# Altium project Final_project.PrjPcb
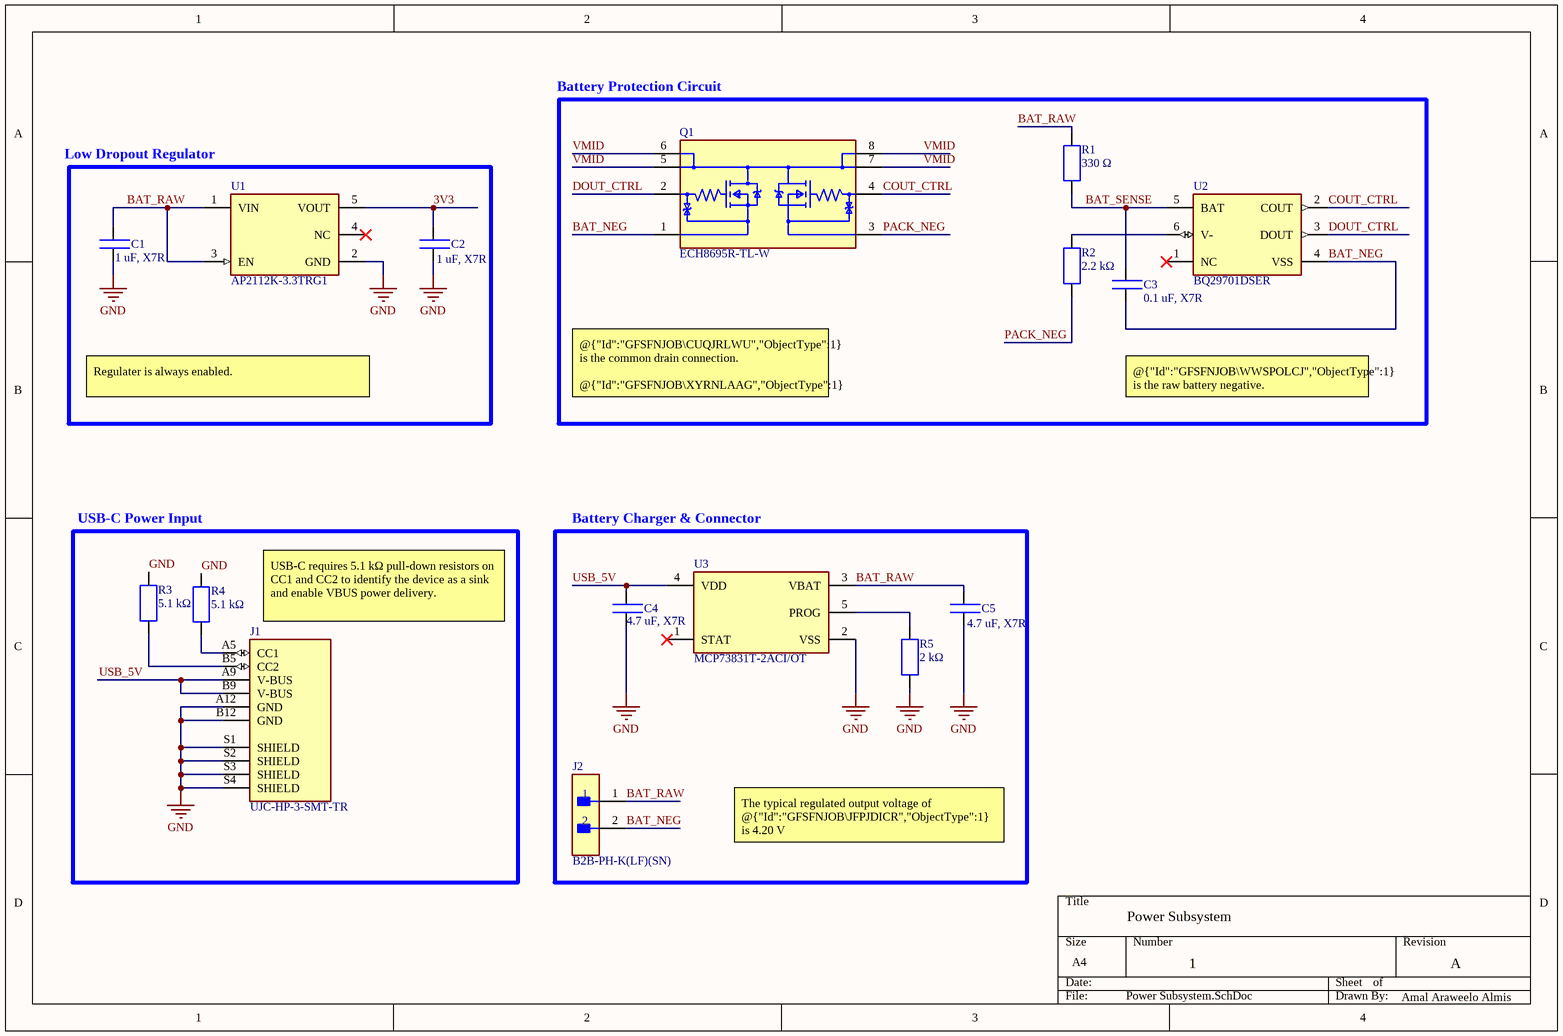
[diagram p0: Power Subsystem.SchDoc]
3 sheets, 30 parts. Net scope: global (net labels, ports and power ports of the same name join across sheets).
Board file: BikeTracker.PcbDoc
Sheets:
  Power Subsystem.SchDoc
  GPS_LoraWAN.SchDoc
  MCU_and_Acc.SchDoc

## Sheet Power Subsystem.SchDoc: Power Subsystem
size A4; DrawnBy: Amal Araweelo Almis; DocumentNumber: SCH-001; Revision: A; SheetNumber: 1; SheetTotal: 3

### Parts
C1  1 uF, X7R  [CAP_0402]
C2  1 uF, X7R  [CAP_0402]
C3  0.1 uF, X7R  [CAP_0402]
C4  4.7 uF, X7R  [CAP_0402]
C5  4.7 uF, X7R  [CAP_0402]
J1  UJC-HP-3-SMT-TR  [CUI_UJC-HP-3-SMT-TR]
J2  B2B-PH-K(LF)(SN)  [FP-B2B-PH-K_LF_SN-MFG]
Q1  ECH8695R-TL-W  [FP-318BF-MFG]
R1  330 Ω  [RES_0402]
R2  2.2 kΩ  [RES_0402]
R3  5.1 kΩ  [RES_0402]
R4  5.1 kΩ  [RES_0402]
R5  2 kΩ  [RES_0402]
U1  AP2112K-3.3TRG1  [FP-SOT25-IPC_C]
U2  BQ29701DSER  [FP-DSE0006A-IPC_A]
U3  MCP73831T-2ACI/OT  [FP-C04-091-OT-IPC_A]

### Blocks framed on the sheet
Battery Protection Circuit: C3 Q1 R1 R2 U2
Low Dropout Regulator: C1 C2 U1
USB-C Power Input: J1 R3 R4
Battery Charger & Connector: C4 C5 J2 R5 U3

### Nets
GND: C1.1 C2.1 C4.1 C5.1 J1.A12(GND) J1.B12(GND) J1.S1(SHIELD) J1.S2(SHIELD) J1.S3(SHIELD) J1.S4(SHIELD) R3.1 R4.2 R5.1 U1.2(GND) U3.2(VSS)
3V3: C2.2 U1.5(VOUT)
BAT_NEG: C3.1 J2.2 Q1.1(Source1) U2.4(VSS)
BAT_RAW: C1.2 C5.2 J2.1 R1.1 U1.1(VIN) U1.3(EN) U3.3(VBAT)
BAT_SENSE: C3.2 R1.2 U2.5(BAT)
COUT_CTRL: Q1.4(Gate2) U2.2(COUT)
DOUT_CTRL: Q1.2(Gate1) U2.3(DOUT)
PACK_NEG: Q1.3(Source2) R2.1
USB_5V: C4.2 J1.A9(V-BUS) J1.B9(V-BUS) U3.4(VDD)
VMID: Q1.5(Drain) Q1.6(Drain) Q1.7(Drain) Q1.8(Drain)
NetJ1_A5: J1.A5(CC1) R4.1
NetJ1_B5: J1.B5(CC2) R3.2
NetR2_2: R2.2 U2.6(V-)
NetR5_2: R5.2 U3.5(PROG)

Not connected (* = marked no-connect by the designer): U1 4(NC)*; U2 1(NC)*; U3 1(STAT)*

### Notes on the sheet
- Regulater is always enabled.
- @{"Id":"GFSFNJOB\CUQJRLWU","ObjectType":1} is the common drain connection.
  @{"Id":"GFSFNJOB\XYRNLAAG","ObjectType":1} is the protected battery negative and should connected to system @{"Id":"MAUZWXRV\VNFEDLCC","ObjectType":1}.
- @{"Id":"GFSFNJOB\WWSPOLCJ","ObjectType":1} is the raw battery negative.
- (near J1) USB-C requires 5.1 kΩ pull-down resistors on CC1 and CC2 to identify the device as a sink and enable VBUS power delivery.
- The typical regulated output voltage of @{"Id":"GFSFNJOB\JFPJDICR","ObjectType":1} is 4.20 V

### Library data of the parts
C1 = CAP_0402: Multilayer Ceramic Capacitors MLCC - SMD/SMT 6.3V 1uF X7R 0402 10% HI CV; Manufacturer 1: YAGEO; Manufacturer Part Number 1: CC0402KRX7R5BB105; Capacitance: 100 pF; Tolerance: 5%; LCSC Part Number: C106200; Supplier 1: Mouser; Supplier Part Number 1: 603-CC402KRX7R5BB105
C2 = CAP_0402: Multilayer Ceramic Capacitors MLCC - SMD/SMT 6.3V 1uF X7R 0402 10% HI CV; Manufacturer: YAGEO; Manufacturer Part Number: CC0402JRNPO9BN101; Capacitance: 100 pF; Tolerance: 5%; LCSC Part Number: C106200
C3 = CAP_0402: Multilayer Ceramic Capacitors MLCC - SMD/SMT 16 V 0.1uF X7R 0402 10%; Capacitance: 100 pF; Tolerance: 5%; Supplier 1: Mouser; Supplier Part Number 1: 603-CC402KRX7R7BB104; LCSC Part Number: C106200
C4 = CAP_0402: Multilayer Ceramic Capacitor MLCC; Manufacturer 1: YAGEO; Manufacturer Part Number 1: CC1206KFX7R9BB475; Capacitance: 100 pF; Tolerance: 5%; LCSC Part Number: C106200; Supplier 1: Mouser; Supplier Part Number 1: 603-CC1206KFX7R9B475
C5 = CAP_0402: Multilayer Ceramic Capacitor MLCC; Manufacturer: YAGEO; Manufacturer Part Number: CC0402JRNPO9BN101; Capacitance: 100 pF; Tolerance: 5%; LCSC Part Number: C106200
J1 = UJC-HP-3-SMT-TR: USB Connectors USB jack, C type, power only, 6 pin, horizonal, gold flash plating, surface mount, T&R; Manufacturer 1: Same Sky; Package: None; Price: None; Value: *; MP: UJC-HP-3-SMT-TR; Availability: Unavailable; Manufacturer Part Number 1: UJC-HP-3-SMT-TR; Supplier 1: Mouser; Supplier Part Number 1: 490-UJC-HP-3-SMT-TR
J2 = CMP-17439-000674-1: Connector Header Through Hole 2 position 0.079" (2.00mm); Manufacturer 1: JST Commercial; Manufacturer Part Number 1: B2B-PH-K-S(LF)(SN); Gender: Male; Pitch: 2mm; Voltage Rating: 100V; Current Rating: 2A; Number of Positions: 2; Insulation Resistance: 1GR; Contact Plating: Tin; Color: Beige; Min Operating Temperature: -25°C; Mount: Through Hole; Number of Rows: 1; Termination: Crimp; Max Operating Temperature: 85°C; Lead Free: Lead Free; Contact Material: Brass; Material: Polyamide; Supplier 1: Mouser; Supplier Part Number 1: 306-B2BPHKSLFSNPP
Q1 = CMP-00278-51167104-1: ECH8695R-TL-W Dual N-Channel Power MOSFET, 24V, 11 A, 9.1 mΩ; Manufacturer Lifecycle Status: ACTIVE; Manufacturer 1: onsemi; Turn-On Delay Time: 300ns; Max Junction Temperature (Tj): 150°C; Rds On Max: 9.1mΩ; Turn-Off Delay Time: 19.7µs; Gate to Source Voltage (Vgs): 12.5V; Drain to Source Resistance: 7mΩ; Rise Time: 320ns; Fall Time: 22.3µs; Power Dissipation: 1.5W; Continuous Drain Current (ID): 11A; Number of Channels: 2; Max Power Dissipation: 1.4W; Mount: Surface Mount; RoHS: Compliant; Number of Pins: 8; Drain to Source Breakdown Voltage: 24V; Min Operating Temperature: -55°C; Width: 2.3mm; Max Operating Temperature: 150°C; Lifecycle Status: Production; Height: 950µm; Contact Plating: Tin; Element Configuration: Dual; Lead Free: Lead Free; Length: 2.9mm; Case/Package: SMD/SMT; Schedule B: 8541290080, 8541290080|8541290080, 8541290080|8541290080|8541290080, 8541290080|8541290080|8541290080|8541290080; Drain to Source Voltage (Vdss): 24V; NexarPartId: 51167104; Manufacturer Part Number 1: ECH8695R-TL-W; Supplier 1: Mouser; Supplier Part Number 1: 863-ECH8695R-TL-W
R1-R5 = RES_0402: Resistor SMD 0402 Generic; Manufacturer: YAGEO; Manufacturer Part Number: RC0402FR07150KL; Tolerance: 1%; Resistance: 150 kOhm; LCSC Part Number: C93947
U1 = CMP-12756-000035-1: IC REG LINEAR 3.3V 600MA SOT25; Manufacturer 1: Diodes Incorporated; Number of Regulators: 1; Output Type: Fixed; Polarity: Positive; Min Input Voltage: 2.5V; Max Input Voltage: 6V; Accuracy: 1.5%; Quiescent Current: 55uA; Dropout Voltage: 250mV; Min Operating Temperature: -40°C; Length: 3.1mm; Output Current: 600mA; Max Operating Temperature: 85°C; Package Quantity: 1; Output Voltage: 3.3V; Width: 1.7mm; Number of Outputs: 1; Packaging: Tape and Reel; Height: 1.3mm; Lead Free: Lead Free; Max Output Current: 600mA; Case/Package: SOT-23-5; Mount: Surface Mount; Number of Pins: 5; Manufacturer Part Number 1: AP2112K-3.3TRG1; Supplier 1: Mouser; Supplier Part Number 1: 621-AP2112K-3.3TRG1; Supplier Unit Price 1: 3.66
U2 = CMP-04911-000034-1: IC LITHIUM BATT PROTECT 6-SON; Manufacturer 1: Texas Instruments; Fault Protection: Over Current; Number of Cells: 1; Operating Supply Voltage: 28V; Number of Pins: 6; RoHS Compliant: Yes; Lead Free: Lead Free; Max Operating Temperature: 85°C; Case/Package: WFDFN; Contact Plating: Gold; Packaging: Tape and Reel; Mount: Surface Mount; Min Operating Temperature: -40°C; Manufacturer Part Number 1: BQ29701DSER; Supplier 1: Mouser; Supplier Part Number 1: 595-BQ29701DSER
U3 = CMP-0133-00143-2: IC CONTROLLR LI-ION 4.2V SOT23-5; Manufacturer 1: Microchip Technology; Max Power Dissipation: 1.54W; Output Current: 500mA; Max Output Voltage: 4.5V; Number of Outputs: 1; Min Output Voltage: 4.168V; Min Supply Voltage: 3.75V; Max Input Voltage: 6V; Voltage Rating: 4.534V; Drain to Source Resistance: 350mR; Max Operating Temperature: 85°C; Length: 0.122inch; Number of Pins: 5; REACH SVHC: No SVHC; Radiation Hardening: No; Min Operating Temperature: -40°C; Weight: 0.00709oz; Contact Plating: Tin; Termination: SMD/SMT; Case/Package: SOT-23; Mount: Surface Mount; Width: 0.071inch; Packaging: Tape and Reel; Number of Cells: 1; Max Charge Current: 500mA; Height: 0.051inch; Number of Channels: 1; Output Voltage: 4.2V; Max Supply Voltage: 6V; Lead Free: Lead Free; Manufacturer Part Number 1: MCP73831T-2ACI/OT; Supplier 1: Mouser; Supplier Part Number 1: 579-MCP73831T-2ACIOT

## Sheet GPS_LoraWAN.SchDoc: GPS and LoraWAN
size A4; DrawnBy: Carles Bataller Sebastiá; Revision: A; SheetNumber: 2; SheetTotal: 3
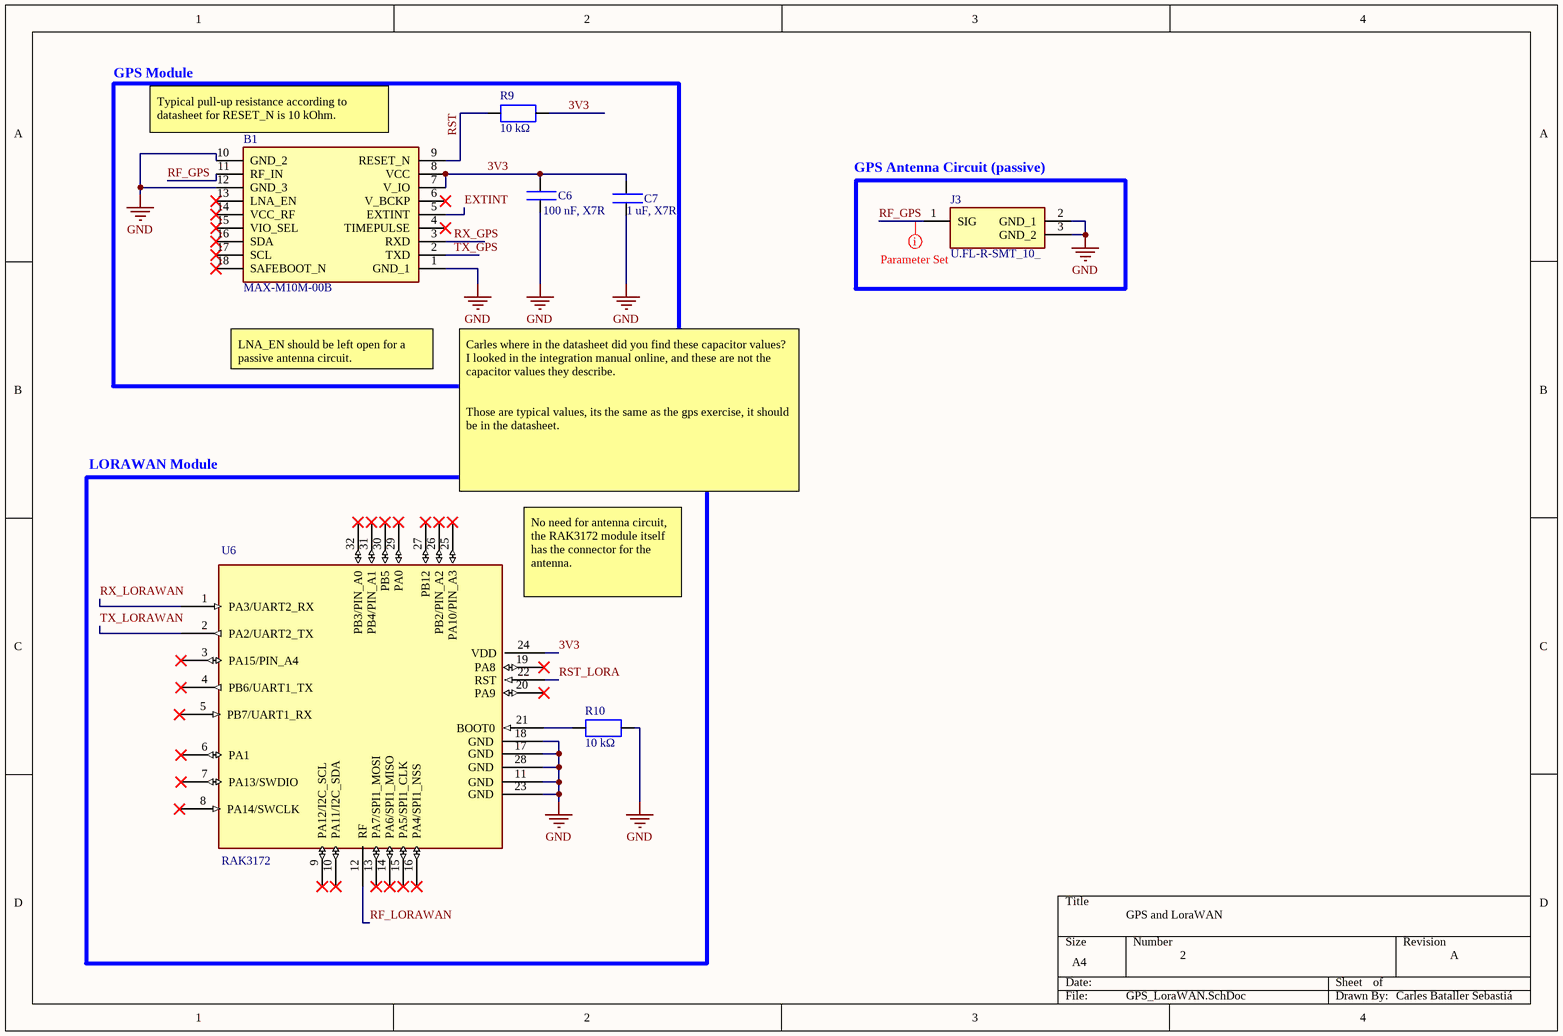
[diagram p1: GPS_LoraWAN.SchDoc]

### Parts
B1  MAX-M10M-00B  [MAXM10M00B]
C6  100 nF, X7R  [CAP_0402]
C7  1 uF, X7R  [CAP_0402]
J3  U.FL-R-SMT_10_  [UFLRSMT10]
R9  10 kΩ  [RES_0402]
R10  10 kΩ  [RES_0201]
U6  RAK3172  [XCVR_RAK3172]

### Blocks framed on the sheet
GPS Module: B1 C6 C7 R9
GPS Antenna Circuit (passive): J3
LORAWAN Module: R10 U6

### Nets
GND: B1.1(GND_1) B1.10(GND_2) B1.12(GND_3) C6.1 C7.1 J3.2(GND_1) J3.3(GND_2) R10.2 U6.11(GND) U6.17(GND) U6.18(GND) U6.23(GND) U6.28(GND)
3V3: B1.7(V_IO) B1.8(VCC) C6.2 C7.2 R9.2 U6.24(VDD)
EXTINT: B1.5(EXTINT)
RF_GPS: B1.11(RF_IN) J3.1(SIG)
RF_LORAWAN: U6.12(RF)
RST: B1.9(RESET_N) R9.1
RST_LORA: U6.22(RST)
RX_GPS: B1.3(RXD)
RX_LORAWAN: U6.1(PA3/UART2_RX)
TX_GPS: B1.2(TXD)
TX_LORAWAN: U6.2(PA2/UART2_TX)
NetR10_1: R10.1 U6.21(BOOT0)

Not connected (* = marked no-connect by the designer): B1 4(TIMEPULSE)* 6(V_BCKP)* 13(LNA_EN)* 14(VCC_RF)* 15(VIO_SEL)* 16(SDA)* 17(SCL)* 18(SAFEBOOT_N)*; U6 3(PA15/PIN_A4)* 4(PB6/UART1_TX)* 5(PB7/UART1_RX)* 6(PA1)* 7(PA13/SWDIO)* 8(PA14/SWCLK)* 9(PA12/I2C_SCL)* 10(PA11/I2C_SDA)* 13(PA7/SPI1_MOSI)* 14(PA6/SPI1_MISO)* 15(PA5/SPI1_CLK)* 16(PA4/SPI1_NSS)* 19(PA8)* 20(PA9)* 25(PA10/PIN_A3)* 26(PB2/PIN_A2)* 27(PB12)* 29(PA0)* 30(PB5)* 31(PB4/PIN_A1)* 32(PB3/PIN_A0)*

### Layout directives
net class RF: RF_GPS

### Notes on the sheet
- (near B1) Typical pull-up resistance according to datasheet for RESET_N is 10 kOhm.
- LNA_EN should be left open for a passive antenna circuit.
- Carles where in the datasheet did you find these capacitor values? I looked in the integration manual online, and these are not the capacitor values they describe.
  Those are typical values, its the same as the gps exercise, it should be in the datasheet.
- (near U6) No need for antenna circuit, the RAK3172 module itself has the connector for the antenna.

### Library data of the parts
B1 = MAX-M10M-00B: GPS Modules u-blox M10 GNSS LCC module, firmware in ROM, crystal oscillator; Geometry.Height: 2.7mm; Manufacturer 1: u-blox; Manufacturer Part Number 1: MAX-M10M-00B; Mouser Part Number: 377-MAX-M10M-00B; Mouser Price/Stock: https://www.mouser.co.uk/ProductDetail/u-blox/MAX-M10M-00B?qs=A6eO%252BMLsxmQGh8%2FJ1ZmexA%3D%3D; Arrow Part Number: MAX-M10M-00B; Arrow Price/Stock: https://www.arrow.com/en/products/max-m10m-00b/u-blox?utm_currency=USD&region=nac; Datasheet Link: https://content.u-blox.com/sites/default/files/documents/MAX-M10M_IntegrationManual_UBX-22038241.pdf; Supplier 1: Mouser; Supplier Part Number 1: 377-MAX-M10M-00B
C6 = CAP_0402: Multilayer Ceramic Capacitors MLCC - SMD/SMT CAP; Capacitance: 100 pF; Tolerance: 5%; Supplier 1: Mouser; Supplier Part Number 1: 581-0402X7R104KT2AT; LCSC Part Number: C106200
C7 = CAP_0402: Multilayer Ceramic Capacitors MLCC - SMD/SMT 6.3V 1uF X7R 0402 10% HI CV; Capacitance: 100 pF; Tolerance: 5%; Supplier 1: YAGEO; Supplier Part Number 1: CC0402JRNPO9BN101; LCSC Part Number: C106200
J3 = U.FL-R-SMT_10_: U.FL (UMCC) Connector Receptacle, Male Pin 50 Ohms Surface Mount Solder; Manufacturer 1: Hirose; Manufacturer Part Number 1: U.FL-R-SMT(10); Geometry.Height: 1.45mm; Supplier Part Number 1: 798-U.FL-R-SMT10; Mouser Price/Stock: https://www.mouser.co.uk/ProductDetail/Hirose-Connector/U.FL-R-SMT10?qs=Ux3WWAnHpjBT1CWD8UMEMQ%3D%3D; Arrow Part Number: U.FL-R-SMT(10); Arrow Price/Stock: https://www.arrow.com/en/products/u.fl-r-smt-10/hirose-electric?utm_currency=USD&region=nac; Datasheet Link: https://eu.mouser.com/datasheet/2/185/hiros05388_1-2269186.pdf; Supplier 1: Mouser
R9 = RES_0402: as R1 on sheet Power Subsystem; LCSC Part Number: C93947
R10 = RES_0201: Thick Film Resistors - SMD 0201 10K0 1% Lead Free; Tolerance: 0.1%; Resistance: 200 Ohm; Supplier 1: Mouser; Supplier Part Number 1: 791-WR02X1002FAR; LCSC Part Number: C852221
U6 = RAK3172: Low-power, long-range transceiver module based on the STM32WLE5CC; Manufacturer 1: RAK; Supplier 1: RAK; Supplier Part Number 1: RAK3172; Manufacturer Part Number 1: RAK3172; Supplier Unit Price 1: 5,99; Supplier Subtotal 1: 5,99

## Sheet MCU_and_Acc.SchDoc: Microcontroller and Accelerometer
size A4; DrawnBy: Carles Bataller Sebastiá; Revision: A; SheetNumber: 3; SheetTotal: 3
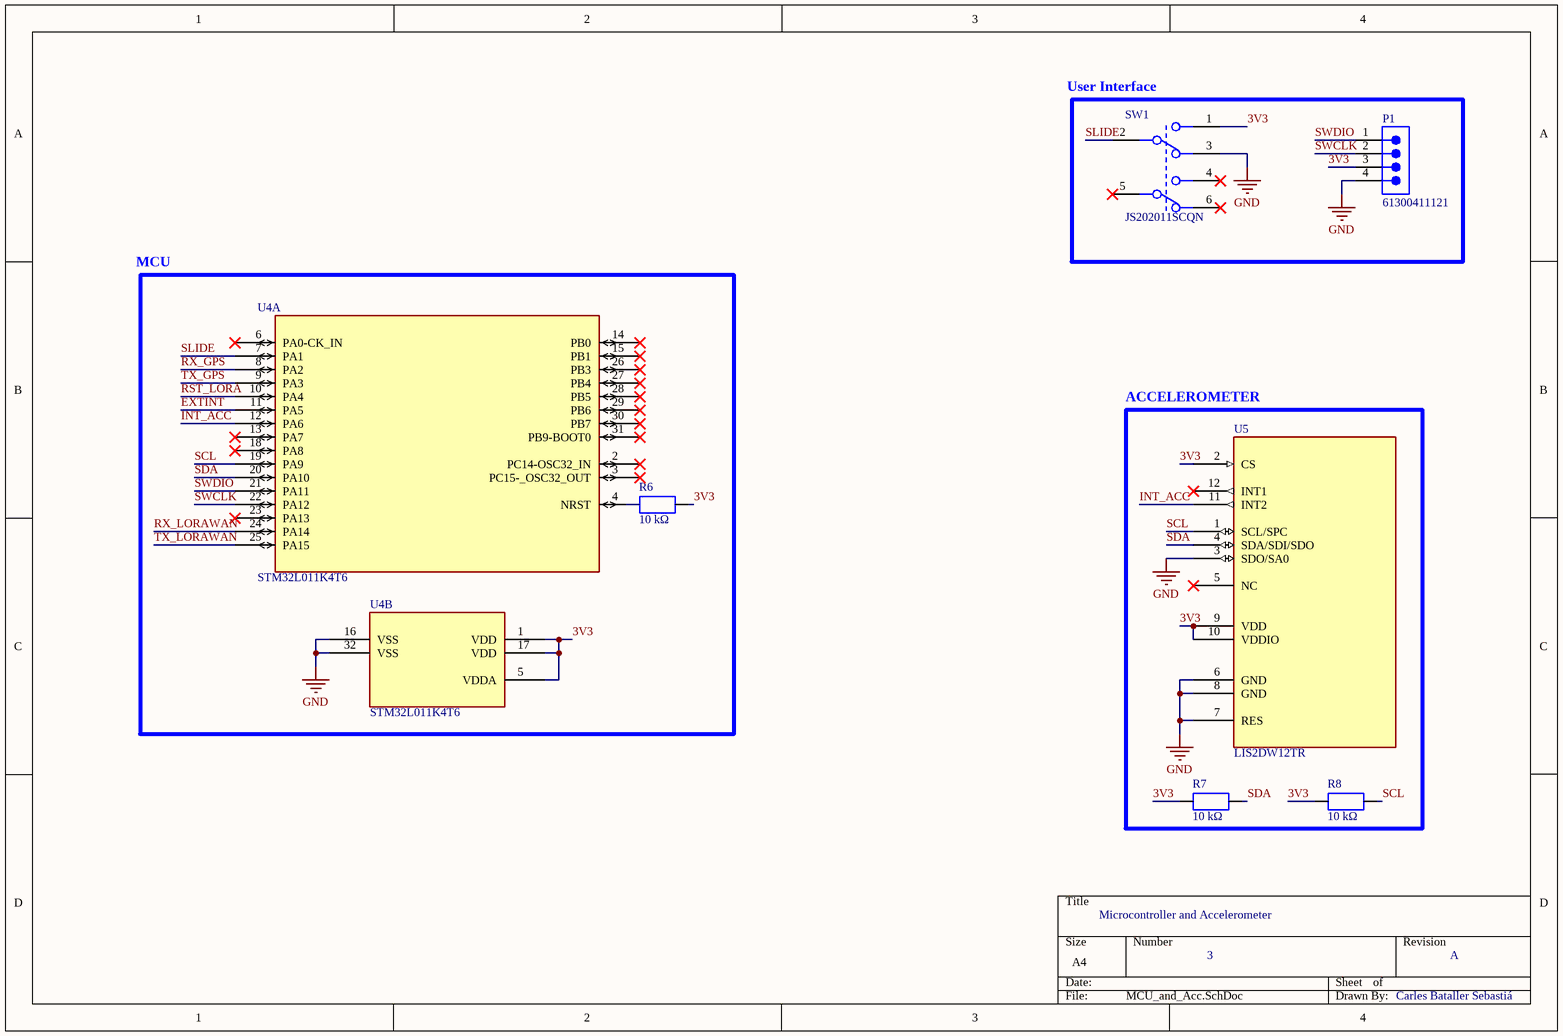
[diagram p2: MCU_and_Acc.SchDoc]

### Parts
P1  61300411121  [61300411121]
R6  10 kΩ  [RES_0201]
R7  10 kΩ  [RES_0201]
R8  10 kΩ  [RES_0201]
SW1  JS202011SCQN  [FP-JS202011SCQN-MFG]
U4  STM32L011K4T6  [LQFP32_7X7X1P4]  (parts A,B of 2)
U5  LIS2DW12TR  [LGA-12_2X2X0P7_STM]

### Blocks framed on the sheet
User Interface: P1 SW1
MCU: R6 U4
ACCELEROMETER: R7 R8 U5

### Nets
GND: P1.4 SW1.3 U4.16(VSS) U4.32(VSS) U5.3(SDO/SA0) U5.6(GND) U5.7(RES) U5.8(GND)
3V3: P1.3 R6.1 R7.2 R8.2 SW1.1 U4.1(VDD) U4.5(VDDA) U4.17(VDD) U5.2(CS) U5.9(VDD) U5.10(VDDIO)
EXTINT: U4.11(PA5)
INT_ACC: U4.12(PA6) U5.11(INT2)
RST_LORA: U4.10(PA4)
RX_GPS: U4.8(PA2)
RX_LORAWAN: U4.24(PA14)
SCL: R8.1 U4.19(PA9) U5.1(SCL/SPC)
SDA: R7.1 U4.20(PA10) U5.4(SDA/SDI/SDO)
SLIDE: SW1.2 U4.7(PA1)
SWCLK: P1.2 U4.22(PA12)
SWDIO: P1.1 U4.21(PA11)
TX_GPS: U4.9(PA3)
TX_LORAWAN: U4.25(PA15)
NetR6_2: R6.2 U4.4(NRST)

Not connected (* = marked no-connect by the designer): SW1 4* 5* 6*; U4 2(PC14-OSC32_IN)* 3(PC15-_OSC32_OUT)* 6(PA0-CK_IN)* 13(PA7)* 14(PB0)* 15(PB1)* 18(PA8)* 23(PA13)* 26(PB3)* 27(PB4)* 28(PB5)* 29(PB6)* 30(PB7)* 31(PB9-BOOT0)*; U5 5(NC)* 12(INT1)*

### Library data of the parts
P1 = CMP-1502-01064-4: THT Vertical Pin Header WR-PHD, Pitch 2.54 mm, Single Row, 4 pins; Manufacturer 1: Würth Elektronik; Connector Type: Male Pin; Gender: Male; Current Rating: 3A; Number of Positions: 4; Operating Supply Voltage: 250V; Contact Resistance: 20mΩ; Pitch: 2.54mm; Max Operating Temperature: 105°C; Mount: Through Hole; Contact Material: Gold; Contact Plating: Gold; Number of Contacts: 4; Orientation: Vertical; Packaging: Bulk; Contact Mating Length: 5.9944mm; Voltage Rating: 250V; Number of Rows: 1; Height: 8.89mm; Lead Free: Lead Free; Lead Pitch: 2.54mm; Number of Pins: 4; Color: Black; Min Operating Temperature: -40°C; RoHS: Compliant; Termination: Solder; Supplier 1: Mouser; Supplier Part Number 1: 710-61300411121; Manufacturer Part Number 1: 61300411121
R6-R8 = RES_0201: as R10 on sheet GPS_LoraWAN; Supplier 1: Mouser; Supplier Part Number 1: 791-WR02X1002FAR; LCSC Part Number: C852221
SW1 = CMP-2000-05087-3: SWITCH SLIDE DPDT 300MA 6V; Manufacturer 1: C&K; Switch Function: On-On; Actuator Type: Standard; Switch Travel: 2mm; Actuator Color: Black; Contact Resistance: 70mR; Electrical Life: 5000Cycles; Actuator Material: Nylon; REACH SVHC: No SVHC; Series: JS; Min Operating Temperature: -20°C; Depth: 7.5mm; Housing Material: Nylon; Voltage Rating (DC): 6V; Max Operating Temperature: 85°C; Contact Current Rating: 300mA; Package Quantity: 1; Contact Plating: Silver; Contact Material: Copper Alloy; Throw Configuration: DPDT; Current Rating: 300mA; Orientation: Vertical; Max Current Rating: 300mA; Max Voltage Rating (DC): 6V; Flammability Rating: UL94 V-2; Length: 9mm; Packaging: Tape and Reel; Mount: Surface Mount; Actuator Length: 2mm; Lead Free: Lead Free; Termination: Gull Wing; Radiation Hardening: No; Supplier 1: Mouser; Supplier Part Number 1: 611-JS202011SCQN; Manufacturer Part Number 1: JS202011SCQN; Supplier Unit Price 1: 0,8; Supplier Subtotal 1: 0,8
U4 = STM32L011K4T6: Ultra-low-power Arm Cortex-M0+ MCU with 16-Kbytes of Flash memory, 32 MHz CPU; Manufacturer 1: STMicroelectronics; Copyright: Copyright (C) 2026 Ultra Librarian. All rights reserved.; Manufacturer Part Number 1: STM32L011K4T6; Datasheet: https://www.st.com/resource/en/datasheet/stm32l011d4.pdf; RefDes: RefDes; Type: Type; Supplier 1: Mouser; Supplier Part Number 1: 511-STM32L011K4T6
U5 = LIS2DW12TR: MEMS digital output motion sensor: high-performance ultralow-power 3-axis &#34;femto&#34; accelerometer; Manufacturer_Name: STMicroelectronics; Copyright: Copyright (C) 2026 Ultra Librarian. All rights reserved.; RefDes: RefDes; Type: Type; Manufacturer_Part_Number: LIS2DW12TR

## Nets that join several sheets
GND: Power Subsystem (15 pins), GPS_LoraWAN (13 pins), MCU_and_Acc (8 pins)
3V3: Power Subsystem (C2.2 U1.5), GPS_LoraWAN (6 pins), MCU_and_Acc (11 pins)
EXTINT: GPS_LoraWAN (B1.5), MCU_and_Acc (U4.11)
RST_LORA: GPS_LoraWAN (U6.22), MCU_and_Acc (U4.10)
RX_GPS: GPS_LoraWAN (B1.3), MCU_and_Acc (U4.8)
RX_LORAWAN: GPS_LoraWAN (U6.1), MCU_and_Acc (U4.24)
TX_GPS: GPS_LoraWAN (B1.2), MCU_and_Acc (U4.9)
TX_LORAWAN: GPS_LoraWAN (U6.2), MCU_and_Acc (U4.25)